# Altium project Ultraschallsensoren_Q_Projeckt.PrjPcb
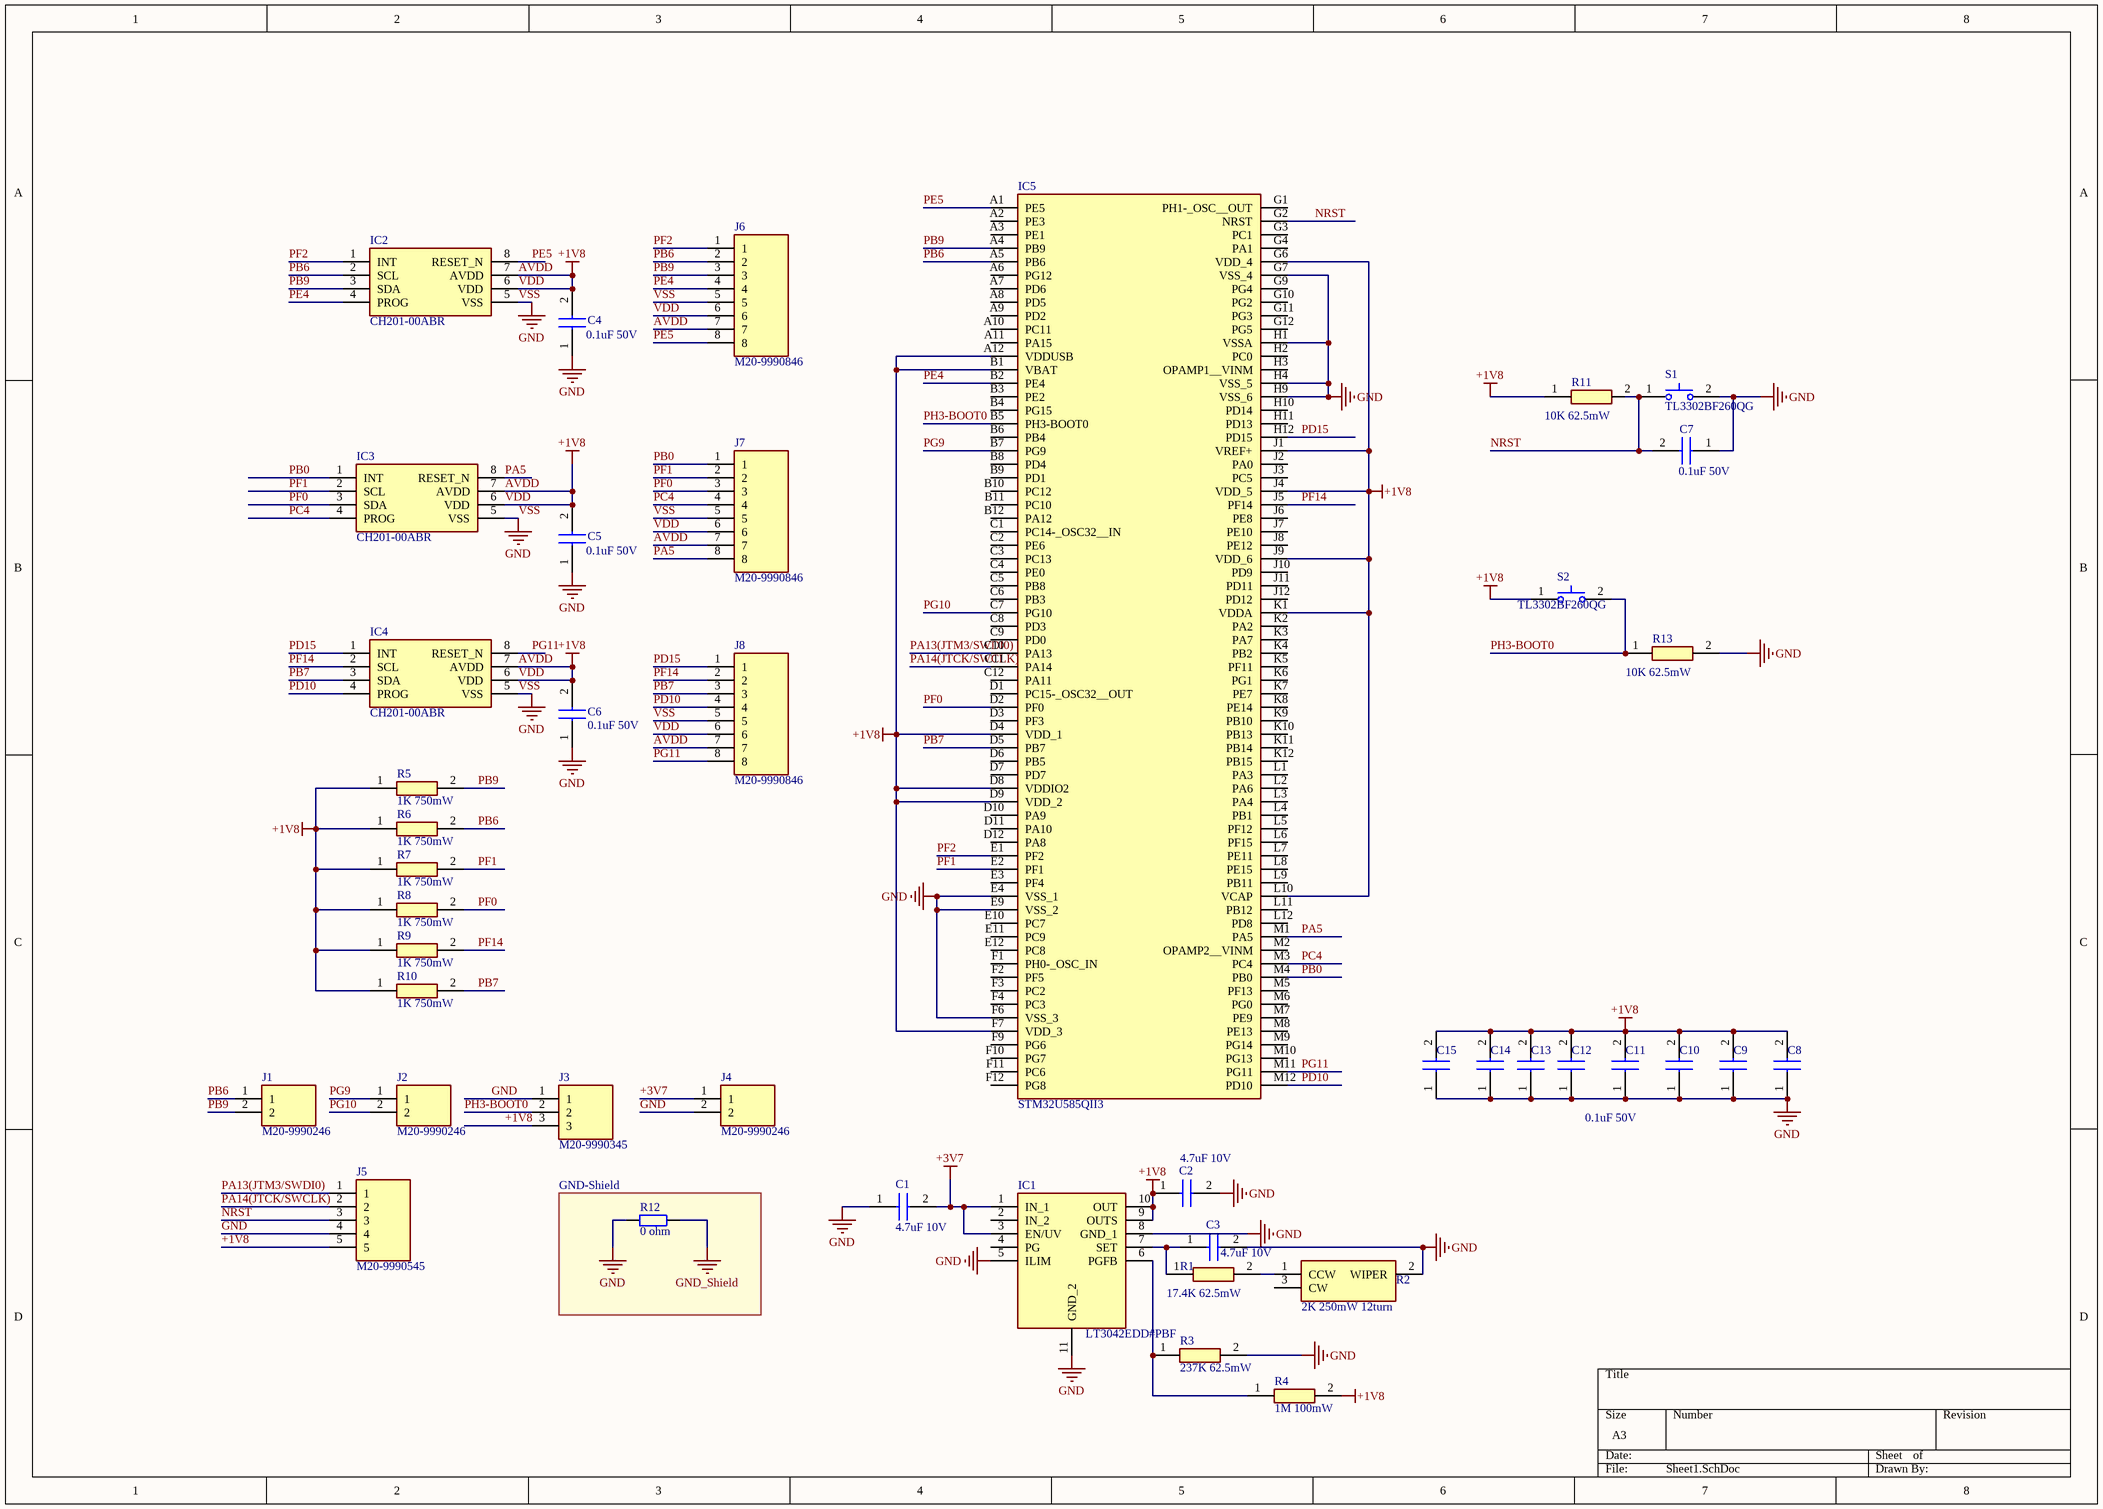
[diagram p0: Sheet1.SchDoc]
1 sheet, 43 parts. Net scope: global (net labels, ports and power ports of the same name join across sheets).
Board file: PCB1.PcbDoc

## Sheet Sheet1.SchDoc
size A3; SheetNumber: 1; SheetTotal: 1; SPICEModelCacheUKBERRFL: <root> / <DocumentId>UKBERRFL</DocumentId> / <CacheFrame Number="0"> / <Model Name="cap" Kind="MDL"> / <Text>*Default semiconductor capacitor / .MODEL CAP C()</Text> / </Model> / <Model Name="respack_8" Kind="CKT"> / <Text>* 8 resistor pack / * / * / .subckt respack_8 1 2 3 4 5 6 7 8 9 10 11 12 13 14 15 16 PARAMS: Value=1k / * / R1 1 16 {Value} / R2 2 15 {Value} / R3 3 14 {Value} / R4 4 13 {Value} / R5 5 12 {Value} / R6 6 11 {Value} / R7 7 10 {Value} / R8 8 9  {Value} / * / .ends respack_8</Text> / </Model> / </CacheFrame> / </root>

### Parts
C1  4.7uF 10V  [CAPC3225X220N]
C2  4.7uF 10V  [CAPC3225X220N]
C3  4.7uF 10V  [CAPC3225X220N]
C4  0.1uF 50V  [CAPC1608X90N]
C5  0.1uF 50V  [CAPC1608X90N]
C6  0.1uF 50V  [CAPC1608X90N]
C7  0.1uF 50V  [CAPC1608X90N]
C8  CC0603KRX7R9BB104  [CAPC1608X90N]  (value not drawn)
C9  CC0603KRX7R9BB104  [CAPC1608X90N]  (value not drawn)
C10  CC0603KRX7R9BB104  [CAPC1608X90N]  (value not drawn)
C11  0.1uF 50V  [CAPC1608X90N]
C12  CC0603KRX7R9BB104  [CAPC1608X90N]  (value not drawn)
C13  CC0603KRX7R9BB104  [CAPC1608X90N]  (value not drawn)
C14  CC0603KRX7R9BB104  [CAPC1608X90N]  (value not drawn)
C15  CC0603KRX7R9BB104  [CAPC1608X90N]  (value not drawn)
IC1  LT3042EDD#PBF  [SON50P300X300X80-11N-D]
IC2  CH201-00ABR  [CH20100ABR]
IC3  CH201-00ABR  [CH20100ABR]
IC4  CH201-00ABR  [CH20100ABR]
IC5  STM32U585QII3  [STM32U585QII3]
J1  M20-9990246  [HDRV2W66P0X254_1X2_508X254X874P]
J2  M20-9990246  [HDRV2W66P0X254_1X2_508X254X874P]
J3  M20-9990345  [HDRV3W64P0X254_1X3_762X254X864P]
J4  M20-9990246  [HDRV2W66P0X254_1X2_508X254X874P]
J5  M20-9990545  [HDRV5W64P0X254_1X5_1270X254X864P]
J6  M20-9990846  [HDRV8W66P0X254_1X8_2032X254X860P]
J7  M20-9990846  [HDRV8W66P0X254_1X8_2032X254X860P]
J8  M20-9990846  [HDRV8W66P0X254_1X8_2032X254X860P]
R1  17.4K 62.5mW  [RESC1005X40N]
R2  2K 250mW 12turn  [3224W1202G]
R3  237K 62.5mW  [RESC1005X40N]
R4  1M 100mW  [RESC1005X37N]
R5  1K 750mW  [RESC1632X65N]
R6  1K 750mW  [RESC1632X65N]
R7  1K 750mW  [RESC1632X65N]
R8  1K 750mW  [RESC1632X65N]
R9  1K 750mW  [RESC1632X65N]
R10  1K 750mW  [RESC1632X65N]
R11  10K 62.5mW  [RESC1005X40N]
R12  0 ohm  [jumper_2.54]
R13  10K 62.5mW  [RESC1005X40N]
S1  TL3302BF260QG  [TL3302BF260QG]
S2  TL3302BF260QG  [TL3302BF260QG]

### Blocks framed on the sheet
GND-Shield: R12

### Nets
+1V8: C2.1 C4.2 C5.2 C6.2 C8.2 C9.2 C10.2 C11.2 C12.2 C13.2 C14.2 C15.2 IC1.9(OUTS) IC1.10(OUT) IC2.6(VDD) IC2.7(AVDD) IC3.6(VDD) IC3.7(AVDD) IC4.6(VDD) IC4.7(AVDD) IC5.A12(VDDUSB) IC5.B1(VBAT) IC5.D4(VDD_1) IC5.D8(VDDIO2) IC5.D9(VDD_2) IC5.F7(VDD_3) IC5.G6(VDD_4) IC5.J1(VREF+) IC5.J4(VDD_5) IC5.J9(VDD_6) IC5.K1(VDDA) IC5.L10(VCAP) J3.3 J5.5 J6.6 J6.7 J7.6 J7.7 J8.6 J8.7 R4.2 R5.1 R6.1 R7.1 R8.1 R9.1 R10.1 R11.1 S2.1(COM)  [also labelled AVDD, VDD]
+3V7: C1.2 IC1.1(IN_1) IC1.3(EN/UV) J4.1
GND: C1.1 C2.2 C3.2 C4.1 C5.1 C6.1 C7.1 C8.1 C9.1 C10.1 C11.1 C12.1 C13.1 C14.1 C15.1 IC1.5(ILIM) IC1.8(GND_1) IC1.11(GND_2) IC2.5(VSS) IC3.5(VSS) IC4.5(VSS) IC5.E4(VSS_1) IC5.E9(VSS_2) IC5.F6(VSS_3) IC5.G7(VSS_4) IC5.H1(VSSA) IC5.H4(VSS_5) IC5.H9(VSS_6) J3.1 J4.2 J5.4 J6.5 J7.5 J8.5 R2.2(WIPER) R3.2 R12.2 R13.2 S1.2(NO)  [also labelled VSS]
GND_Shield: R12.1
NRST: C7.2 IC5.G2(NRST) J5.3 R11.2 S1.1(COM)
PA5: IC3.8(RESET_N) IC5.M1(PA5) J7.8
PA13(JTM3/SWDI0): IC5.C10(PA13) J5.1
PA14(JTCK/SWCLK): IC5.C11(PA14) J5.2
PB0: IC3.1(INT) IC5.M4(PB0) J7.1
PB6: IC2.2(SCL) IC5.A5(PB6) J1.1 J6.2 R6.2
PB7: IC4.3(SDA) IC5.D5(PB7) J8.3 R10.2
PB9: IC2.3(SDA) IC5.A4(PB9) J1.2 J6.3 R5.2
PC4: IC3.4(PROG) IC5.M3(PC4) J7.4
PD10: IC4.4(PROG) IC5.M12(PD10) J8.4
PD15: IC4.1(INT) IC5.H12(PD15) J8.1
PE4: IC2.4(PROG) IC5.B2(PE4) J6.4
PE5: IC2.8(RESET_N) IC5.A1(PE5) J6.8
PF0: IC3.3(SDA) IC5.D2(PF0) J7.3 R8.2
PF1: IC3.2(SCL) IC5.E2(PF1) J7.2 R7.2
PF2: IC2.1(INT) IC5.E1(PF2) J6.1
PF14: IC4.2(SCL) IC5.J5(PF14) J8.2 R9.2
PG9: IC5.B7(PG9) J2.1
PG10: IC5.C7(PG10) J2.2
PG11: IC4.8(RESET_N) IC5.M11(PG11) J8.8
PH3-BOOT0: IC5.B5(PH3-BOOT0) J3.2 R13.1 S2.2(NO)
NetC3_1: C3.1 IC1.7(SET) R1.1
NetIC1_6: IC1.6(PGFB) R3.1 R4.1
NetR1_2: R1.2 R2.1(CCW)

Not connected (* = marked no-connect by the designer): IC1 2(IN_2) 4(PG); IC5 A2(PE3) A3(PE1) A6(PG12) A7(PD6) A8(PD5) A9(PD2) A10(PC11) A11(PA15) B3(PE2) B4(PG15) B6(PB4) B8(PD4) B9(PD1) B10(PC12) B11(PC10) B12(PA12) C1(PC14-_OSC32__IN) C2(PE6) C3(PC13) C4(PE0) C5(PB8) C6(PB3) C8(PD3) C9(PD0) C12(PA11) D1(PC15-_OSC32__OUT) D3(PF3) D6(PB5) D7(PD7) D10(PA9) D11(PA10) D12(PA8) E3(PF4) E10(PC7) E11(PC9) E12(PC8) F1(PH0-_OSC_IN) F2(PF5) F3(PC2) F4(PC3) F9(PG6) F10(PG7) F11(PC6) F12(PG8) G1(PH1-_OSC__OUT) G3(PC1) G4(PA1) G9(PG4) G10(PG2) G11(PG3) G12(PG5) H2(PC0) H3(OPAMP1__VINM) H10(PD14) H11(PD13) J2(PA0) J3(PC5) J6(PE8) J7(PE10) J8(PE12) J10(PD9) J11(PD11) J12(PD12) K2(PA2) K3(PA7) K4(PB2) K5(PF11) K6(PG1) K7(PE7) K8(PE14) K9(PB10) K10(PB13) K11(PB14) K12(PB15) L1(PA3) L2(PA6) L3(PA4) L4(PB1) L5(PF12) L6(PF15) L7(PE11) L8(PE15) L9(PB11) L11(PB12) L12(PD8) M2(OPAMP2__VINM) M5(PF13) M6(PG0) M7(PE9) M8(PE13) M9(PG14) M10(PG13); R2 3(CW)

### Library data of the parts
C1-C3 = 1210X475K100CT: Capacitor; Manufacturer_Name: Walsin Technology Corporation; Datasheet Link: https://componentsearchengine.com/Datasheets/34/1210X475K100CT.pdf; Height: 2.2mm; Manufacturer_Part_Number: 1210X475K100CT
C4-C15 = CC0603KRX7R9BB104: Capacitor; Manufacturer_Name: KEMET; Datasheet Link: http://componentsearchengine.com/Datasheets/3/CC0603KRX7R9BB104.pdf; Height: 0.9mm; Manufacturer_Part_Number: CC0603KRX7R9BB104; Mouser Part Number: 603-CC603KRX7R9BB104; Mouser Price/Stock: https://www.mouser.co.uk/ProductDetail/YAGEO/CC0603KRX7R9BB104?qs=vTakOoo5QyLvVCYM2ge8LQ%3D%3D; Arrow Part Number: CC0603KRX7R9BB104; Arrow Price/Stock: https://www.arrow.com/en/products/cc0603krx7r9bb104/yageo?region=nac
IC1 = LT3042EDD#PBF: Integrated Circuit; Manufacturer_Name: Linear Technology; Datasheet Link: http://www.farnell.com/datasheets/1941078.pdf; Height: 0.8mm; Manufacturer_Part_Number: LT3042EDD#PBF; Mouser Part Number: 584-LT3042EDD#PBF; Mouser Price/Stock: https://www.mouser.co.uk/ProductDetail/Analog-Devices-Linear-Technology/LT3042EDDPBF?qs=oahfZPh6IAIAxPHCQtsgLA%3D%3D; Arrow Part Number: LT3042EDD#PBF; Arrow Price/Stock: https://www.arrow.com/en/products/lt3042eddpbf/linear-technology
IC2-IC4 = CH201-00ABR: Filter; Manufacturer_Name: TDK; Datasheet Link: https://www.arrow.com/en/products/ch201-00abr/invensense; Height: 1.26mm; Manufacturer_Part_Number: CH201-00ABR; Mouser Part Number: 410-CH201-00ABR; Mouser Price/Stock: https://www.mouser.co.uk/ProductDetail/TDK-InvenSense/CH201-00ABR?qs=hWgE7mdIu5SG9AjHdakrVw%3D%3D; Arrow Part Number: CH201-00ABR; Arrow Price/Stock: https://www.arrow.com/en/products/ch201-00abr/invensense?region=europe
IC5 = STM32U585QII3: Integrated Circuit; Manufacturer_Name: STMicroelectronics; Datasheet Link: https://www.st.com/resource/en/datasheet/stm32u585qi.pdf; Height: 0.6mm; Manufacturer_Part_Number: STM32U585QII3; Mouser Part Number: 511-STM32U585QII3; Mouser Price/Stock: https://www.mouser.co.uk/ProductDetail/STMicroelectronics/STM32U585QII3?qs=DRkmTr78QARnx%2FRwQ92zzA%3D%3D; Arrow Part Number: STM32U585QII3; Arrow Price/Stock: https://www.arrow.com/en/products/stm32u585qii3/stmicroelectronics?region=nac
J1 J2 J4 = M20-9990246: Connector; Manufacturer_Name: Harwin; Datasheet Link: https://cdn.harwin.com/pdfs/M20-999.pdf; Height: 8.74mm; Manufacturer_Part_Number: M20-9990246; Mouser Part Number: 855-M20-9990246; Mouser Price/Stock: https://www.mouser.co.uk/ProductDetail/Harwin/M20-9990246?qs=Jph8NoUxIfWjw4WmyRvzag%3D%3D
J3 = M20-9990345: Connector; Manufacturer_Name: Harwin; Datasheet Link: https://cdn.harwin.com/pdfs/M20-999.pdf; Height: 8.64mm; Manufacturer_Part_Number: M20-9990345; Mouser Part Number: 855-M20-9990345; Mouser Price/Stock: https://www.mouser.co.uk/ProductDetail/Harwin/M20-9990345?qs=ulE8k0yEMYbl6ZPCtNdmpA%3D%3D
J5 = M20-9990545: Connector; Manufacturer_Name: Harwin; Datasheet Link: https://componentsearchengine.com/Datasheets/2/M20-9990545.pdf; Height: 8.64mm; Manufacturer_Part_Number: M20-9990545; Mouser Part Number: 855-M20-9990545; Mouser Price/Stock: https://www.mouser.co.uk/ProductDetail/Harwin/M20-9990545?qs=ulE8k0yEMYY1AaFSSzjXzw%3D%3D
J6-J8 = M20-9990846: Connector; Manufacturer_Name: Harwin; Datasheet Link: https://componentsearchengine.com/Datasheets/2/M20-9990846.pdf; Height: 8.6mm; Manufacturer_Part_Number: M20-9990846; Mouser Part Number: 855-M20-9990846; Mouser Price/Stock: https://www.mouser.co.uk/ProductDetail/Harwin/M20-9990846?qs=ulE8k0yEMYb37YKanNqd%2FQ%3D%3D
R1 = CR0402-FX-1742GLF: Resistor; Manufacturer_Name: Bourns; Datasheet Link: https://www.bourns.com/pdfs/CR0402.pdf; Height: 0.4mm; Manufacturer_Part_Number: CR0402-FX-1742GLF; Mouser Part Number: 652-CR0402-FX1742GLF; Mouser Price/Stock: https://www.mouser.com/Search/Refine.aspx?Keyword=652-CR0402-FX1742GLF
R2 = 3224W-1-202G: Variable Resistor; Manufacturer_Name: Bourns; Datasheet Link: https://www.mouser.co.uk/datasheet/2/54/3224-776900.pdf; Height: 5.3mm; Manufacturer_Part_Number: 3224W-1-202G; Mouser Part Number: 652-3224W-1-202G; Mouser Price/Stock: https://www.mouser.co.uk/ProductDetail/Bourns/3224W-1-202G?qs=%252BqDi%252BEsvRViqIHN9%252Bbjs6Q%3D%3D
R3 = CR0402-FX-2373GLF: Resistor; Manufacturer_Name: Bourns; Datasheet Link: https://www.bourns.com/pdfs/CR0402.pdf; Height: 0.4mm; Manufacturer_Part_Number: CR0402-FX-2373GLF; Mouser Part Number: 652-CR0402FX2373GLF; Mouser Price/Stock: https://www.mouser.co.uk/ProductDetail/Bourns/CR0402-FX-2373GLF/?qs=B0uw3wJAhvv3CZtz0TGHkw%3D%3D
R4 = MCS0402MD1004BE000: Resistor; Manufacturer_Name: Vishay; Datasheet Link: http://www.vishay.com/docs/28705/mcx0x0xpro.pdf; Height: 0.37mm; Manufacturer_Part_Number: MCS0402MD1004BE000; Mouser Part Number: 594-MCS0402MD1004BE0; Mouser Price/Stock: https://www.mouser.co.uk/ProductDetail/Vishay/MCS0402MD1004BE000?qs=Jslch3jnSjn7xkAlRofMAA%3D%3D; Arrow Part Number: MCS0402MD1004BE000; Arrow Price/Stock: https://www.arrow.com/en/products/mcs0402md1004be000/vishay?region=nac
R5-R10 = LTR18EZPF1001: Resistor; Manufacturer_Name: ROHM Semiconductor; Datasheet Link: https://datasheet.datasheetarchive.com/originals/distributors/Datasheets_SAMA/3380804eece3bdd53d019225060e3334.pdf; Height: 0.65mm; Manufacturer_Part_Number: LTR18EZPF1001; Mouser Part Number: 755-LTR18EZPF1001; Mouser Price/Stock: https://www.mouser.com/Search/Refine.aspx?Keyword=755-LTR18EZPF1001
R11 R13 = SFR01MZPF1002: Resistor; Manufacturer_Name: ROHM Semiconductor; Datasheet Link: https://componentsearchengine.com/Datasheets/1/SFR01MZPF1002.pdf; Height: 0.4mm; Manufacturer_Part_Number: SFR01MZPF1002; Mouser Part Number: 755-SFR01MZPF1002; Mouser Price/Stock: https://www.mouser.co.uk/ProductDetail/ROHM-Semiconductor/SFR01MZPF1002?qs=byeeYqUIh0PM%2FLqo1px8tQ%3D%3D
R12 = Res2: Resistor; Value: 1650 ohm; Published: 8-Jun-2000; LatestRevisionDate: 17-Jul-2002; LatestRevisionNote: Re-released for DXP Platform.; PackageReference: AXIAL-0.4; Publisher: Altium Limited; PackageDescription: Axial Device, Thru-Hole; 2 Leads; 0.4 in Pin Spacing
S1 S2 = TL3302BF260QG: Switch (2-Pin Push); Manufacturer_Name: E-Switch; Datasheet Link: https://datasheet.datasheetarchive.com/originals/dk/DKDS-10/195395.pdf; Height: 5.25mm; Manufacturer_Part_Number: TL3302BF260QG; Mouser Part Number: 612-TL3302BF260QG; Mouser Price/Stock: https://www.mouser.co.uk/ProductDetail/E-Switch/TL3302BF260QG?qs=QtyuwXswaQgzIcPTNLB4LA%3D%3D